# Altium project Q7 mini.PrjPcb
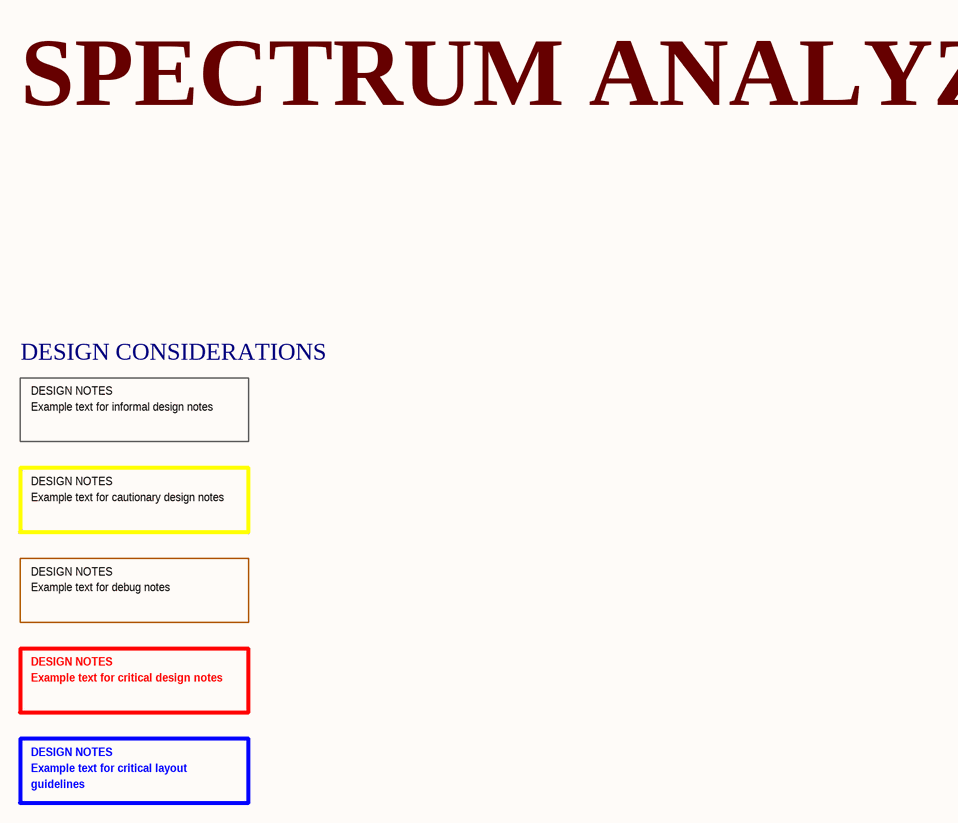
[diagram p0: [01] - COVER PAGE.SchDoc]
2 sheets, 30 parts. Net scope: global (net labels, ports and power ports of the same name join across sheets).
Board file: Q7 mini.PcbDoc
Sheets:
  [01] - COVER PAGE.SchDoc
  [02] - MAIN.SchDoc

## Sheet [01] - COVER PAGE.SchDoc: COVER PAGE
size A4; Organization: Bjørn Brodtkorb; Address1: Frode Rinnans veg 161; Address2: 7050 Trondheim; DocumentNumber: 6598; Revision: 1.0; SheetNumber: 1; SheetTotal: 1

### Notes on the sheet
- SPECTRUM ANALYZER
- DESIGN CONSIDERATIONS
- DESIGN NOTES
- Example text for informal design notes
- Example text for cautionary design notes
- Example text for debug notes
- Example text for critical design notes
- Example text for critical layout
- guidelines
- Title
- Size:
- Date:
- A4
- Number:
- Time:
- Revision:
- Sheet
- of
- File:

## Sheet [02] - MAIN.SchDoc: Power
size A4; Organization: Tor Brodtkorb; Address1: Frode Rinnans veg 193; Address2: 7050 Trondheim; DocumentNumber: 6598; Revision: 1.0; SheetNumber: 1; SheetTotal: 1
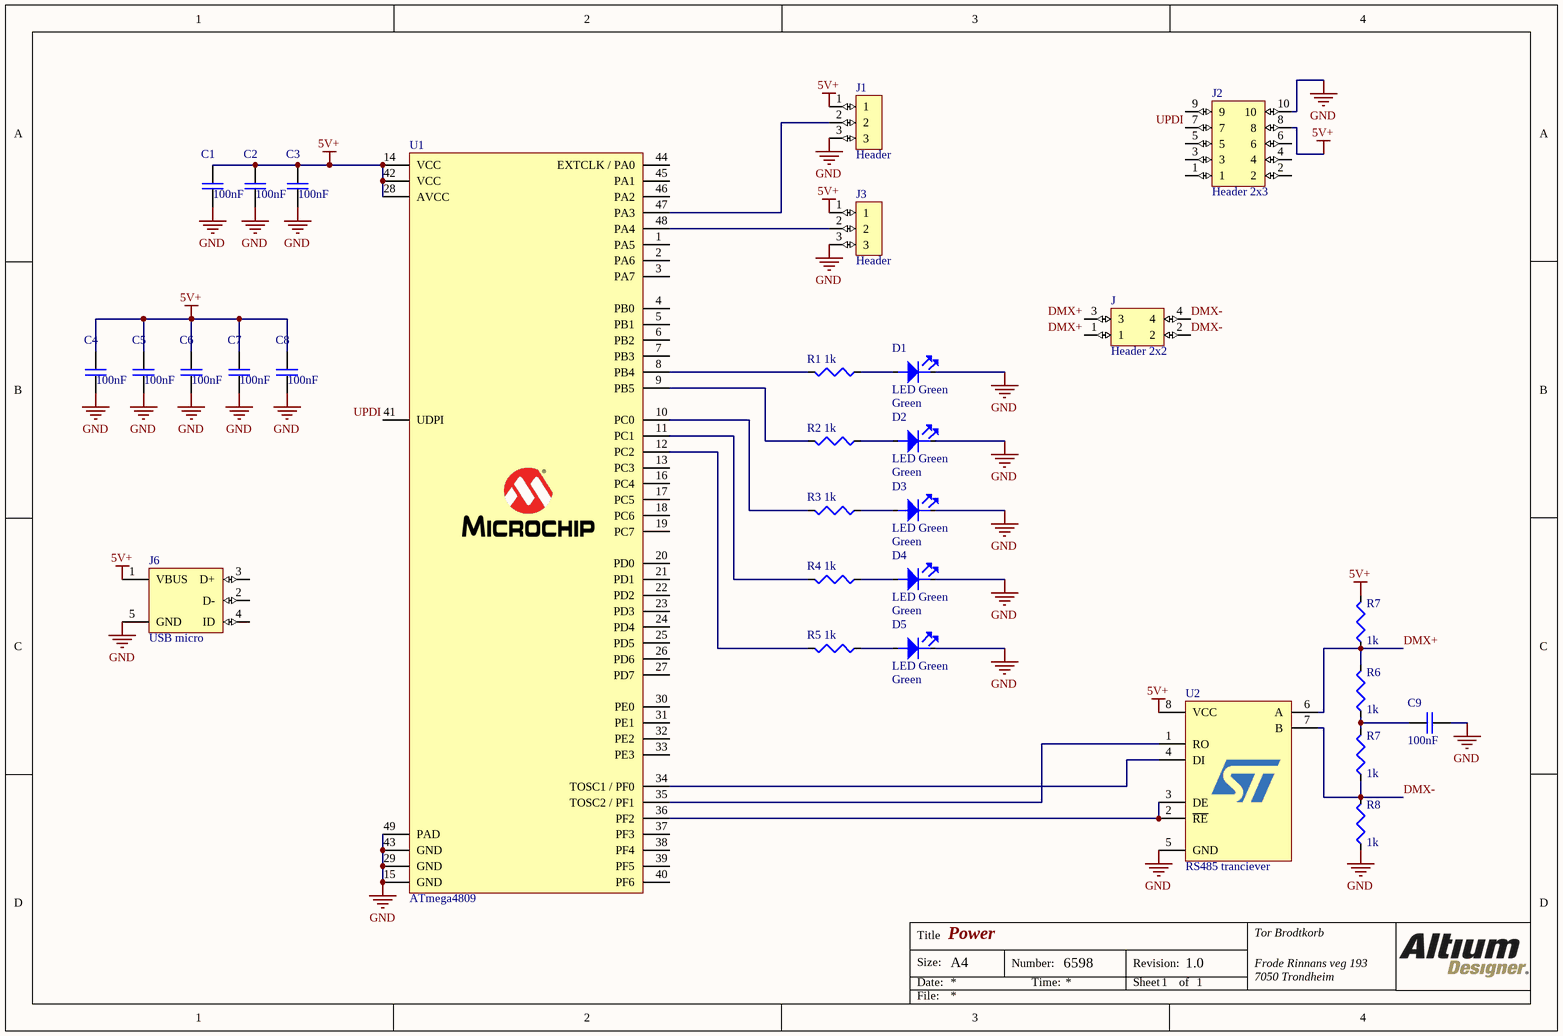
[diagram p1: [02] - MAIN.SchDoc]

### Parts
(Parts that share a designator on the sheet are numbered #1, #2 ... from top to bottom, then left to right.)
C1  value 100nF  [C0603]  (hidden comment: 02016D104KAT2A)
C2  value 100nF  [C0603]  (hidden comment: 02016D104KAT2A)
C3  value 100nF  [C0603]  (hidden comment: 02016D104KAT2A)
C4  value 100nF  [C0603]  (hidden comment: 02016D104KAT2A)
C5  value 100nF  [C0603]  (hidden comment: 02016D104KAT2A)
C6  value 100nF  [C0603]  (hidden comment: 02016D104KAT2A)
C7  value 100nF  [C0603]  (hidden comment: 02016D104KAT2A)
C8  value 100nF  [C0603]  (hidden comment: 02016D104KAT2A)
C9  value 100nF  [C0603]  (hidden comment: 02016D104KAT2A)
D1  LED Green  Color: Green  [L0603 GREEN]
D2  LED Green  Color: Green  [L0603 GREEN]
D3  LED Green  Color: Green  [L0603 GREEN]
D4  LED Green  Color: Green  [L0603 GREEN]
D5  LED Green  Color: Green  [L0603 GREEN]
J  Header 2x2  [Header 2x2 2.54mm right angle male]
J1  Header  [Header 1x3 2.54mm]
J2  Header 2x3  [Header 2x5 1.27mm]
J3  Header  [Header 1x3 2.54mm]
J6  USB micro  [USB micro]
R1  value 1k  [R0603]  (hidden comment: CPF-A-0603B100KE1)
R2  value 1k  [R0603]  (hidden comment: CPF-A-0603B100KE1)
R3  value 1k  [R0603]  (hidden comment: CPF-A-0603B100KE1)
R4  value 1k  [R0603]  (hidden comment: CPF-A-0603B100KE1)
R5  value 1k  [R0603]  (hidden comment: CPF-A-0603B100KE1)
R6  value 1k  [R0603]  (hidden comment: CPF-A-0603B100KE1)
R7#1  value 1k  [R0603]  (hidden comment: CPF-A-0603B100KE1)
R7#2  value 1k  [R0603]  (hidden comment: CPF-A-0603B100KE1)
R8  value 1k  [R0603]  (hidden comment: CPF-A-0603B100KE1)
U1  ATmega4809  [ATMEGA4809-MFR]
U2  RS485 tranciever  [ST485CDR]

### Nets
5V+: C1.2 C2.2 C3.2 C4.2 C5.2 C6.2 C7.2 C8.2 J1.1 J2.8 J3.1 J6.1(VBUS) R7#1.2 U1.14(VCC) U1.28(AVCC) U1.42(VCC) U2.8(VCC)
GND: C1.1 C2.1 C3.1 C4.1 C5.1 C6.1 C7.1 C8.1 C9.1 D1.2 D2.2 D3.2 D4.2 D5.2 J1.3 J2.10 J3.3 J6.5(GND) R8.1 U1.15(GND) U1.29(GND) U1.43(GND) U1.49(PAD) U2.5(GND)
DMX+: J.1 J.3 R6.2 R7#1.1 U2.6(A)
DMX-: J.2 J.4 R7#2.1 R8.2 U2.7(B)
UPDI: J2.7 U1.41(UDPI)
NetC9_2: C9.2 R6.1 R7#2.2
NetD1_1: D1.1 R1.1
NetD2_1: D2.1 R2.1
NetD3_1: D3.1 R3.1
NetD4_1: D4.1 R4.1
NetD5_1: D5.1 R5.1
NetJ1_2: J1.2 U1.47(PA3)
NetJ3_2: J3.2 U1.48(PA4)
NetR1_2: R1.2 U1.8(PB4)
NetR2_2: R2.2 U1.9(PB5)
NetR3_2: R3.2 U1.10(PC0)
NetR4_2: R4.2 U1.11(PC1)
NetR5_2: R5.2 U1.12(PC2)
NetU1_34: U1.34(TOSC1_/_PF0) U2.4(DI)
NetU1_35: U1.35(TOSC2_/_PF1) U2.1(RO)
NetU1_36: U1.36(PF2) U2.2(~{RE}) U2.3(DE)

Not connected (* = marked no-connect by the designer): J2 1 2 3 4 5 6 9; J6 2(D-) 3(D+) 4(ID); U1 1(PA5) 2(PA6) 3(PA7) 4(PB0) 5(PB1) 6(PB2) 7(PB3) 13(PC3) 16(PC4) 17(PC5) 18(PC6) 19(PC7) 20(PD0) 21(PD1) 22(PD2) 23(PD3) 24(PD4) 25(PD5) 26(PD6) 27(PD7) 30(PE0) 31(PE1) 32(PE2) 33(PE3) 37(PF3) 38(PF4) 39(PF5) 40(PF6) 44(EXTCLK_/_PA0) 45(PA1) 46(PA2)

### Notes on the sheet
- Title
- Size:
- Date:
- A4
- Number:
- Time:
- Revision:
- Sheet
- of
- File:

### Library data of the parts
C1-C9 = 02016D104KAT2A: C0603
D1-D5 = HSMG-C196: LED 0603 Green
J = 609-3342-ND: Header 2x2 2.54mm, male, right angle
J1 J3 = 2212S-05SG-83: Header 1x3 2.54mm female
J2 = 20021111-00010T4LF: Header  2x5 1.27mm male
J6 = 47590-0001
R1-R6 R7#1 R7#2 R8 = CPF-A-0603B100KE1: R0603
U1 = ATMEGA4809-MFR: ATmega4809 48-pin UQFN
U2 = ST485CDR